# EAGLE design breakout (EAGLE 8.0.0)
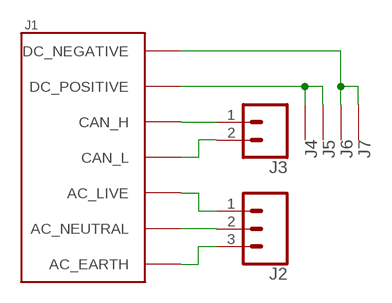
[diagram p0: schematic, sheet 1]

## Parts
J1  FLATPACK2_CON  [FLATPACK2_CON]
J2  WEIDMULLER_PM_508  [WEIDMULLER_PM_508]
J3  CONN_021X02_NO_SILK  [1X02_NO_SILK]
J4  FLATPACK2_DC_LUG  [FLATPACK2_DC_LUG]
J5  FLATPACK2_DC_LUG  [FLATPACK2_DC_LUG]
J6  FLATPACK2_DC_LUG  [FLATPACK2_DC_LUG]
J7  FLATPACK2_DC_LUG  [FLATPACK2_DC_LUG]

## Nets
N$1: J1.CAN_H_TOP(CAN_H) J3.1
N$2: J1.CAN_L_TOP(CAN_L) J3.2
N$3: J1.AC_LIVE_BOTTOM(AC_LIVE) J1.AC_LIVE_TOP(AC_LIVE) J2.1
N$4: J1.AC_NEUTRAL_BOTTOM(AC_NEUTRAL) J1.AC_NEUTRAL_TOP(AC_NEUTRAL) J2.2
N$5: J1.DC_POSITIVE_BOTTOM(DC_POSITIVE) J1.DC_POSITIVE_TOP(DC_POSITIVE) J4.P$1(PIN) J5.P$1(PIN)
N$6: J1.AC_EARTH J2.3
N$8: J1.DC_NEGATIVE_BOTTOM(DC_NEGATIVE) J1.DC_NEGATIVE_TOP(DC_NEGATIVE) J6.P$1(PIN) J7.P$1(PIN)

## Library data of the parts
J1 = flatpack2-edge-connector:FLATPACK2_CON: Edge connector for an Eltek Flatpack2
J2 = connectors:WEIDMULLER_PM_508
J3 = SparkFun-Connectors:CONN_02: Multi connection point. Often used as Generic Header-pin footprint for 0.1 inch spaced/style header connections On any of the 0.1 inch spaced packages, you can populate with these: Break Away Headers - Straight <https://www.sparkfun.com/products/116> (PRT-00116) Break Away Male Headers - Right Angle <https://www.sparkfun.com/products/553> (PRT-00553) Female Headers <https://www.sparkfun.com/products/115> (PRT-00115) Break Away Headers - Machine Pin <https://www.sparkfun.com/products/117> (PRT-00117) Break Away Female Headers - Swiss Machine Pin <https://www.sparkfun.com/products/743> (PRT-00743) For SCREWTERMINALS and SPRING TERMINALS visit here: Screw Terimnals on SparkFun.com <https://www.sparkfun.com/search/results?term=Screw+Terminals> (5mm/3.5mm/2.54mm spacing) This device is also useful as a general connection point to wire up your design to another part of your project. Our various solder wires solder well into these plated through hole pads. Hook-Up Wire - Assortment (Stranded, 22 AWG) <https://www.sparkfun.com/products/11375> (PRT-11375) Hook-Up Wire - Assortment (Solid Core, 22 AWG) <https://www.sparkfun.com/products/11367> (PRT-11367) View the entire wire category on our website here <https://www.sparkfun.com/categories/141> Special notes: Molex polarized connector foot print use with: PRT-08233 with associated crimp pins and housings. 2.54_SCREWTERM for use with PRT-10571. 3.5mm Screw Terminal footprints for PRT-08084 5mm Screw Terminal footprints for use with PRT-08432
J4-J7 = connectors:FLATPACK2_DC_LUG

## Board
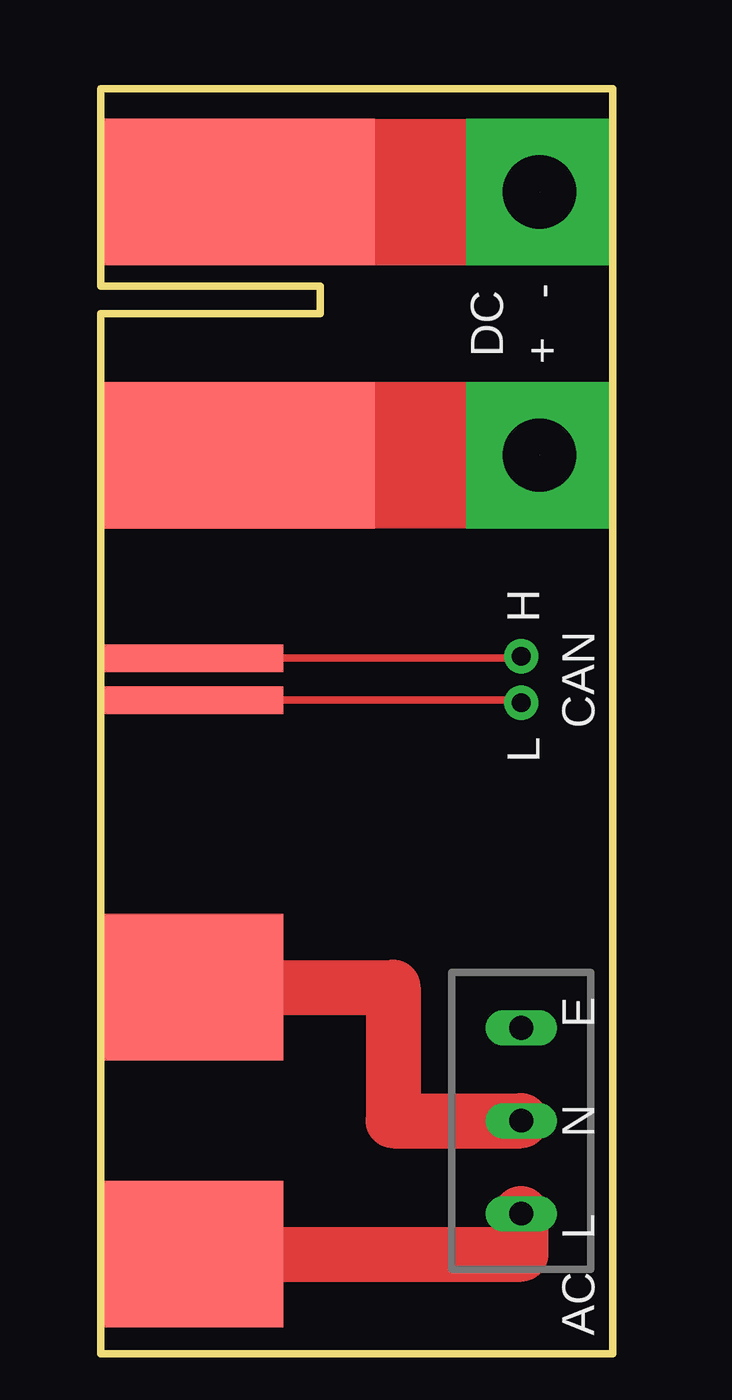
[diagram p1: board, top side]
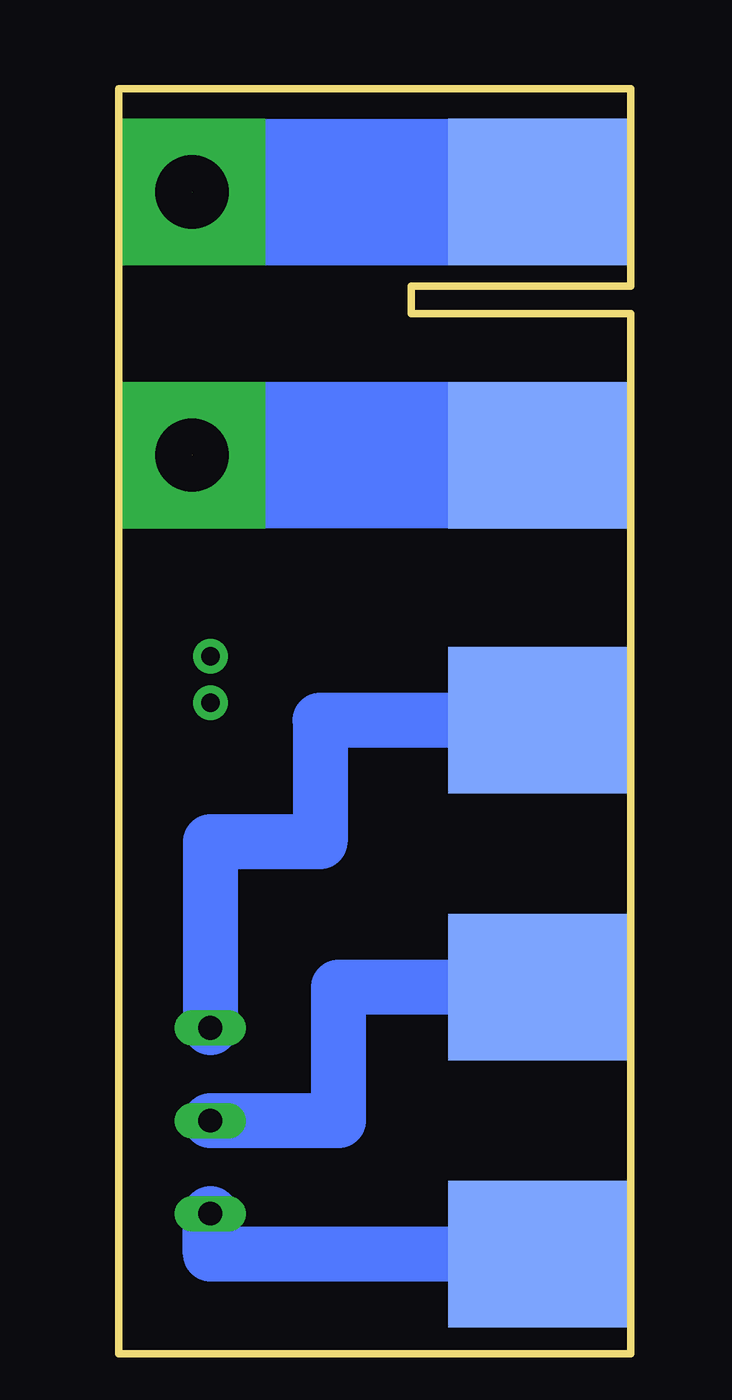
[diagram p2: board, bottom side, seen from below]

Size 28 x 69.2 mm. Coordinates in mm from the lower left corner, seen from the top.
Outline: 0,0 0,56.9 12,56.9 12,58.4 0,58.4 0,69.2 28,69.2 28,0 0,0
Copper layers (1*16): Top 0.035mm / dielectric 1.5mm / Bottom 0.035mm
Design rules "default": minimum track width 10mil, minimum drill 24mil, track to track 8mil, track to pad 8mil, pad to pad 8mil, via to via 8mil, smd to smd 8mil, copper to edge 40mil, drill to drill 8mil, minimum pad ring 10mil, minimum via ring 8mil, stop-mask expansion 4mil, vias tented up to drill 0mil, thermal gap 10mil

### Footprints (pad centres in the part's own frame; a part is rotated, then mirrored left to right if it is on the bottom)
FLATPACK2_CON = smd 10 x 8 bottom: AC_EARTH 5,0.05; AC_LIVE_BOTTOM 5,-29.15; AC_NEUTRAL_BOTTOM 5,-14.55; DC_NEGATIVE_BOTTOM 5,28.95; DC_POSITIVE_BOTTOM 5,14.55 | smd 10 x 8: AC_LIVE_TOP 5,-29.15; AC_NEUTRAL_TOP 5,-14.55 | smd 10 x 1.5: CAN_H_TOP 5,3.45; CAN_L_TOP 5,1.15 | smd 15 x 8: DC_NEGATIVE_TOP 7.5,28.95; DC_POSITIVE_TOP 7.5,14.55
WEIDMULLER_PM_508 = drill 1.3 long: 1 0,5.08; 2 0,0; 3 0,-5.08
1X02_NO_SILK = drill 1.016 pad 1.88: 1 0,0; 2 2.54,0
FLATPACK2_DC_LUG = drill 4 pad 8 square: P$1 0,0

### Placement (x,y rotation side)
J1  0,34.6 0 top
J2  23,12.75 180 top
J3  23,38.15 270 top
J4  24,49.15 0 bottom
J5  24,49.15 0 top
J6  24,63.55 0 bottom
J7  24,63.55 0 top

### Tracks (layer width: path | path; a pad name or v marks a point on that pad's centre or on a via)
N$1
  Top 0.406: J1.CAN_H_TOP 23,38.05 J3.1
N$2
  Top 0.406: J1.CAN_L_TOP 23,35.75 J3.2
N$3
  Top 3: J1.AC_LIVE_TOP 23,5.45 J2.1
  Bottom 3: J1.AC_LIVE_TOP 23,5.45 J2.1
N$4
  Top 3: J1.AC_NEUTRAL_TOP 16,20.05 16,12.75 J2.2
  Bottom 3: J1.AC_NEUTRAL_TOP 16,20.05 16,12.75 J2.2
N$5  (1 unrouted)
  Top 8: J1.DC_POSITIVE_TOP J4.P$1
  Bottom 8: J1.DC_POSITIVE_BOTTOM J4.P$1
N$6
  Bottom 3: J1.AC_EARTH 17,34.65 17,28 23,28 J2.3
N$8  (1 unrouted)
  Top 8: J1.DC_NEGATIVE_TOP J6.P$1
  Bottom 8: J1.DC_NEGATIVE_BOTTOM J6.P$1

### Text on the board
tPlace: - | DC | + | H | CAN | L | E | N | L | AC